# EAGLE design LUPA+uZED (EAGLE 8.3.1)
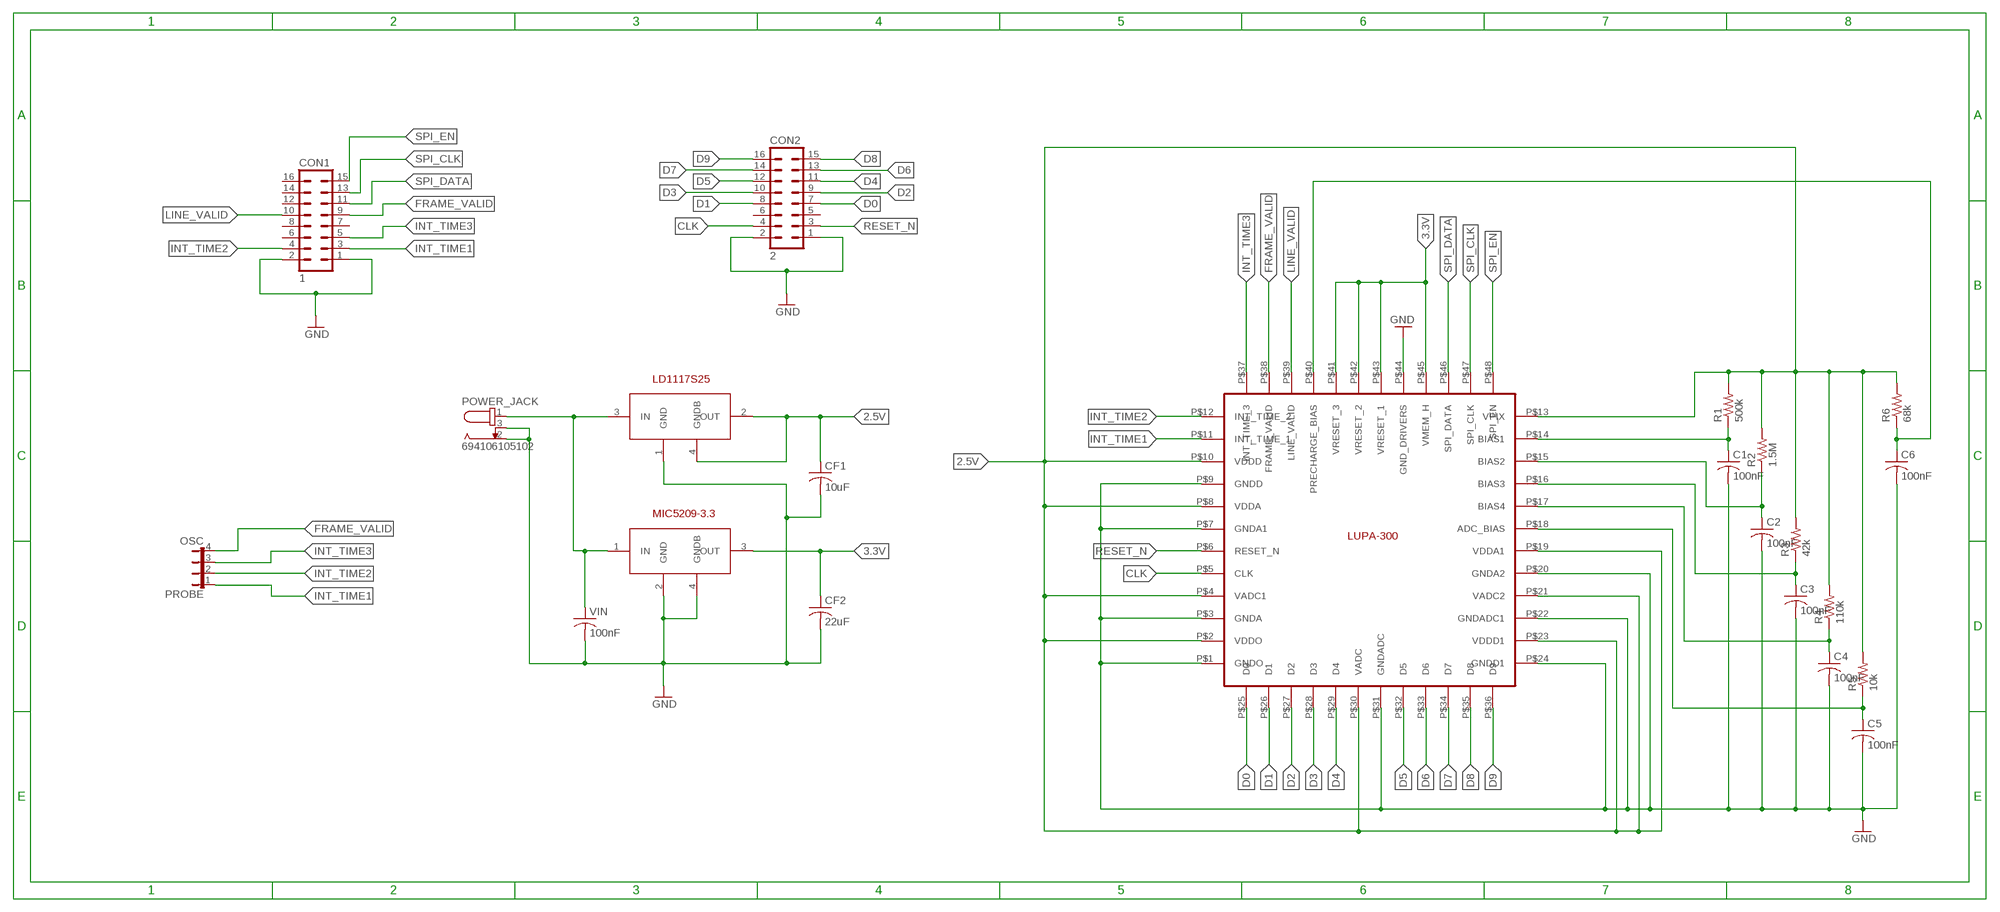
[diagram p0: schematic, sheet 1]

## Parts
C1  100nF  C-USC3216  [C3216]
C2  100nF  C-USC3216  [C3216]
C3  100nF  C-USC3216  [C3216]
C4  100nF  C-USC3216  [C3216]
C5  100nF  C-USC3216  [C3216]
C6  100nF  C-USC3216  [C3216]
CF1  10uF  C-USC3216  [C3216]
CF2  22uF  C-USC3216  [C3216]
CON1  1  MA08-2  [MA08-2]
CON2  2  MA08-2  [MA08-2]
POWER_JACK  694106105102  [694106105102]
PROBE  OSC  JP4E  [JP4]
R1  500k  R-US_R1206  [R1206]
R2  1.5M  R-US_R1206  [R1206]
R3  42k  R-US_R1206  [R1206]
R4  110k  R-US_R1206  [R1206]
R5  10k  R-US_R1206  [R1206]
R6  68k  R-US_R1206  [R1206]
U$1  IS  LUPA300  [LUPA300]
U$2  LD1117S25  [SOT223]
U$3  MIC5209-3.3  [SOT223]
VIN  100nF  C-USC3216  [C3216]

## Nets
2.5V: CF1.1 R1.2 R2.2 R3.2 R4.2 R5.2 R6.2 U$1.P$2(VDDO) U$1.P$4(VADC1) U$1.P$8(VDDA) U$1.P$10(VDDD) U$1.P$13(VPIX) U$1.P$19(VDDA1) U$1.P$21(VADC2) U$1.P$23(VDDD1) U$1.P$30(VADC) U$2.2(OUT) U$2.4(GNDB)
3.3V: CF2.1 U$1.P$41(VRESET_3) U$1.P$42(VRESET_2) U$1.P$43(VRESET_1) U$1.P$45(VMEM_H) U$3.3(OUT)
CLK: CON2.4 U$1.P$5(CLK)
D0: CON2.7 U$1.P$25(D0)
D1: CON2.8 U$1.P$26(D1)
D2: CON2.9 U$1.P$27(D2)
D3: CON2.10 U$1.P$28(D3)
D4: CON2.11 U$1.P$29(D4)
D5: CON2.12 U$1.P$32(D5)
D6: CON2.13 U$1.P$33(D6)
D7: CON2.14 U$1.P$34(D7)
D8: CON2.15 U$1.P$35(D8)
D9: CON2.16 U$1.P$36(D9)
FRAME_VALID: CON1.9 PROBE.4 U$1.P$38(FRAME_VALID)
GND: C1.2 C2.2 C3.2 C4.2 C5.2 C6.2 CF1.2 CF2.2 CON1.1 CON1.2 CON2.1 CON2.2 POWER_JACK.2 POWER_JACK.3 U$1.P$1(GNDO) U$1.P$3(GNDA) U$1.P$7(GNDA1) U$1.P$9(GNDD) U$1.P$20(GNDA2) U$1.P$22(GNDADC1) U$1.P$24(GNDD1) U$1.P$31(GNDADC) U$1.P$44(GND_DRIVERS) U$2.1(GND) U$3.2(GND) U$3.4(GNDB) VIN.2
INT_TIME1: CON1.3 PROBE.1 U$1.P$11(INT_TIME_1)
INT_TIME2: CON1.4 PROBE.2 U$1.P$12(INT_TIME_2)
INT_TIME3: CON1.5 PROBE.3 U$1.P$37(INT_TIME_3)
LINE_VALID: CON1.10 U$1.P$39(LINE_VALID)
N$2: C1.1 R1.1 U$1.P$14(BIAS1)
N$3: C2.1 R2.1 U$1.P$15(BIAS2)
N$4: C4.1 R4.1 U$1.P$17(BIAS4)
N$7: C3.1 R3.1 U$1.P$16(BIAS3)
N$8: C5.1 R5.1 U$1.P$18(ADC_BIAS)
N$10: C6.1 R6.1 U$1.P$40(PRECHARGE_BIAS)
N$11: POWER_JACK.1 U$2.3(IN) U$3.1(IN) VIN.1
RESET_N: CON2.3 U$1.P$6(RESET_N)
SPI_CLK: CON1.13 U$1.P$47(SPI_CLK)
SPI_DATA: CON1.11 U$1.P$46(SPI_DATA)
SPI_EN: CON1.15 U$1.P$48(SPI_EN)
Unconnected: CON1.6 CON1.7 CON1.8 CON1.12 CON1.14 CON1.16 CON2.5 CON2.6

## Library data of the parts
C1-C6 CF1 CF2 VIN = resistor:C-US: CAPACITOR, American symbol
CON1 CON2 = con-lstb:MA08-2: PIN HEADER; OC_FARNELL: unknown; OC_NEWARK: unknown
POWER_JACK = Wurth_Elektronik_Electromechanic_DC_Power_Jack_Connectors_rev15c:694106105102: WR-DC_DC Power Jack_Right Angled_SMT Center Pin Ø2.0_Plug ID Ø2.05_Plug OD Ø5.5_with Peg ;=>Code : Con_WR-DC_SMT_694106105102_694106105102 <http://katalog.we-online.de/media/images/eican/Con_WR-DC_SMT_694106105102_pf2.jpg> Details see: http://katalog.we-online.de/em/datasheet/6941xx105102.pdf Created 2014-10-08, Karrer Zheng 2014 (C) Wurth Elektronik
PROBE = jumper:JP4E: JUMPER
R1-R6 = resistor:R-US_: RESISTOR, American symbol
U$1 = lupa300:LUPA300
U$2 = LD1117S25:LD1117S25
U$3 = MIC5209-3.3:MIC5209-3.3

## Board
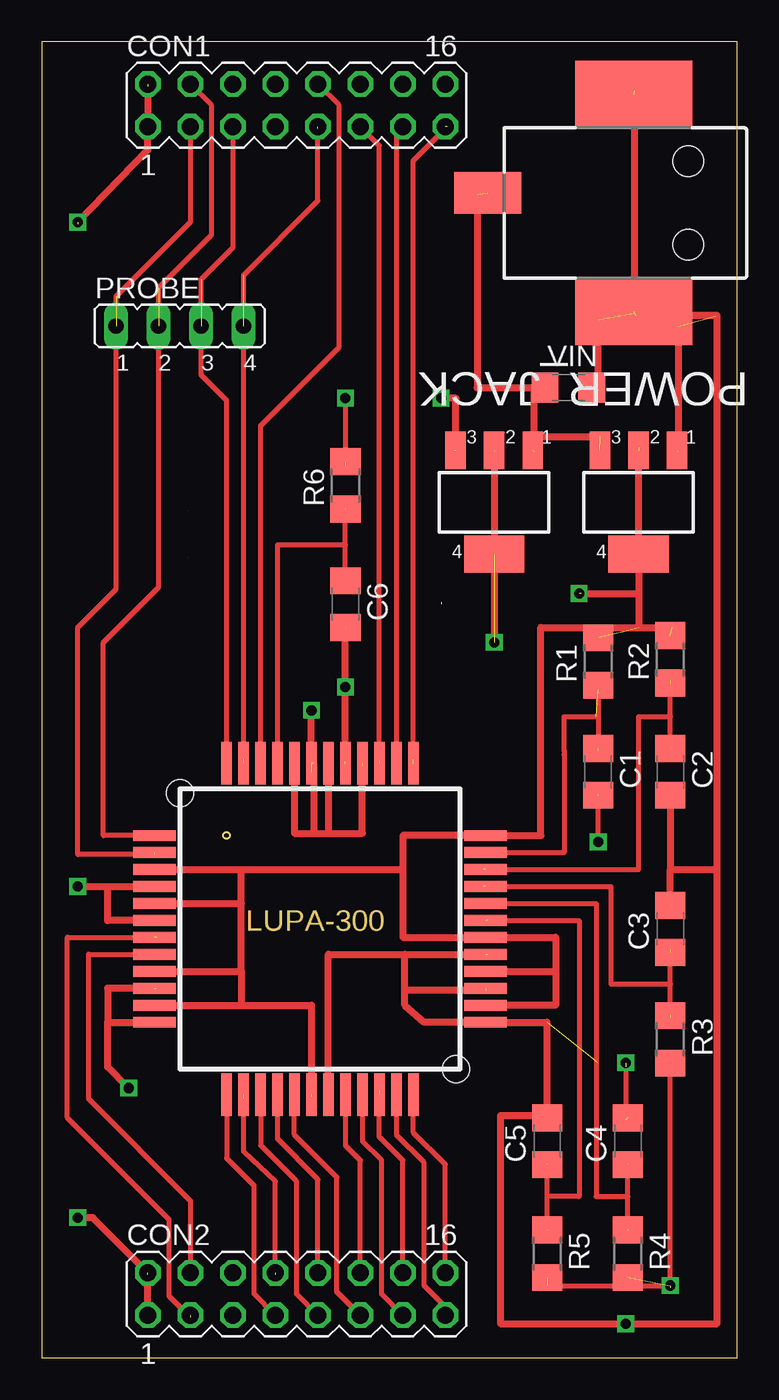
[diagram p1: board, top side]
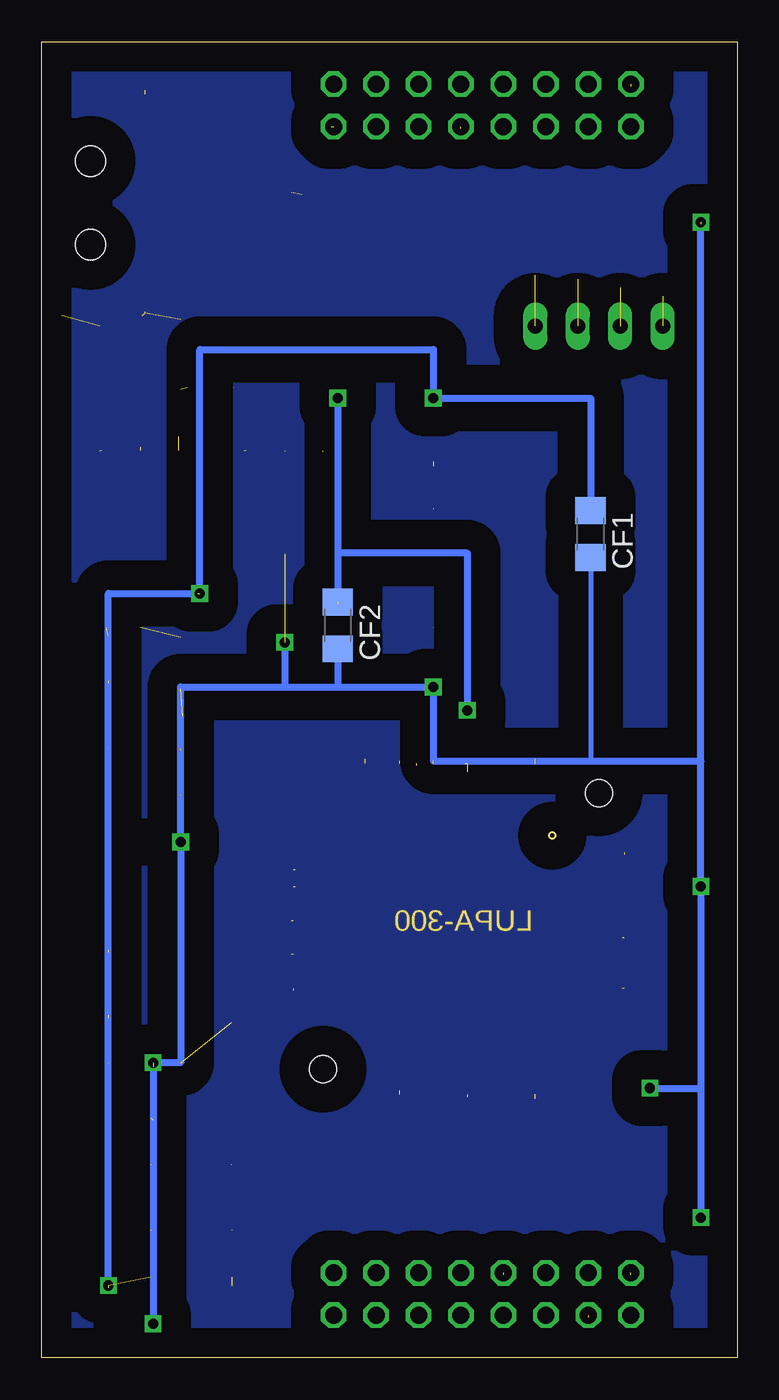
[diagram p2: board, bottom side, seen from below]

Size 41.58 x 78.73 mm. Coordinates in mm from the lower left corner, seen from the top.
Outline: 0,0 41.58,0 41.58,78.73 0,78.73 0,0
Copper layers (1*16): Top 0.035mm / dielectric 1.5mm / Bottom 0.035mm
Design rules "default *": minimum track width 6mil, minimum drill 0.35mm, track to track 0.1032mm, track to pad 0.1032mm, pad to pad 0.1032mm, via to via 0.1032mm, smd to smd 0.1032mm, copper to edge 40mil, drill to drill 6mil, minimum pad ring 10mil, minimum via ring 8mil, stop-mask expansion 4mil, vias tented up to drill 0mil, thermal gap 10mil

### Footprints (pad centres in the part's own frame; a part is rotated, then mirrored left to right if it is on the bottom)
C3216 = smd 1.6 x 1.8: 1 -1.4,0; 2 1.4,0
MA08-2 = drill 1.016 octagon: 1 -8.89,-1.27; 2 -8.89,1.27; 3 -6.35,-1.27; 4 -6.35,1.27; 5 -3.81,-1.27; 6 -3.81,1.27; 7 -1.27,-1.27; 8 -1.27,1.27; 9 1.27,-1.27; 10 1.27,1.27; 11 3.81,-1.27; 12 3.81,1.27; 13 6.35,-1.27; 14 6.35,1.27; 15 8.89,-1.27; 16 8.89,1.27
694106105102 = smd 4 x 2.5: 1 15.5,-0.6 | smd 7 x 4: 2 6.75,6.5; 3 6.75,-6.5 | hole 1.8: 3.5,2.5; 3.5,-2.5
JP4 = drill 0.914 long: 1 -3.81,0; 2 -1.27,0; 3 1.27,0; 4 3.81,0
R1206 = smd 1.6 x 1.803: 1 -1.422,0; 2 1.422,0
LUPA300 = smd 2.54 x 0.635: P$1 -2.794,1.524; P$2 -2.794,2.54; P$3 -2.794,3.556; P$4 -2.794,4.572; P$5 -2.794,5.588; P$6 -2.794,6.604; P$7 -2.794,7.62; P$8 -2.794,8.636; P$9 -2.794,9.652; P$10 -2.794,10.668; P$11 -2.794,11.684; P$12 -2.794,12.7; P$13 17.018,12.7; P$14 17.018,11.684; P$15 17.018,10.668; P$16 17.018,9.652; P$17 17.018,8.636; P$18 17.018,7.62; P$19 17.018,6.604; P$20 17.018,5.588; P$21 17.018,4.572; P$22 17.018,3.556; P$23 17.018,2.54; P$24 17.018,1.524 | smd 0.635 x 2.54: P$25 1.524,-2.794; P$26 2.54,-2.794; P$27 3.556,-2.794; P$28 4.572,-2.794; P$29 5.588,-2.794; P$30 6.604,-2.794; P$31 7.62,-2.794; P$32 8.636,-2.794; P$33 9.652,-2.794; P$34 10.668,-2.794; P$35 11.684,-2.794; P$36 12.7,-2.794; P$37 1.524,17.018; P$38 2.54,17.018; P$39 3.556,17.018; P$40 4.572,17.018; P$41 5.588,17.018; P$42 6.604,17.018; P$43 7.62,17.018; P$44 8.636,17.018; P$45 9.652,17.018; P$46 10.668,17.018; P$47 11.684,17.018; P$48 12.7,17.018 | hole 1.6: -1.27,15.24; 15.24,-1.27
SOT223 = smd 1.219 x 2.235: 1 -2.311,-3.099; 2 0,-3.099; 3 2.311,-3.099 | smd 3.6 x 2.2: 4 0,3.099

### Placement (x,y rotation side)
C1  33.27,35.05 270 top
C2  37.59,35.05 270 top
C3  37.59,25.65 90 top
C4  35.05,12.95 90 top
C5  30.23,12.95 90 top
C6  18.16,45.09 270 top
CF1  8.76,49.28 270 bottom
CF2  23.88,43.81 270 bottom
CON1  15.24,74.93 0 top
CON2  15.24,3.81 0 top
POWER_JACK  42.16,69.09 180 top
PROBE  8.26,61.72 0 top
R1  33.27,41.66 90 top
R2  37.59,41.78 90 top
R3  37.59,19.05 270 top
R4  35.05,6.22 270 top
R5  30.23,6.22 270 top
R6  18.16,52.2 90 top
U$1  9.53,18.54 0 top
U$2  35.69,51.18 180 top
U$3  27.05,51.18 180 top
VIN  31.5,58.04 0 top

### Tracks (layer width: path | path; a pad name or v marks a point on that pad's centre or on a via)
2.5V  (via drill 0.6)  (11 unrouted)
  Top 0.305: 30.23,4.32 v37.59,4.32 37.59,17.65 | v18.16,57.4 18.16,53.34
  Top 0.406: 21.59,29.21 21.59,31.24 U$1.P$13 29.84,31.24 29.84,43.69 35.69,43.69 | 21.59,29.21 21.59,25.15 U$1.P$19 | U$1.P$19 26.67,25.15 | U$1.P$10 11.94,29.21 | 11.94,29.21 21.59,29.21 | U$1.P$8 11.94,27.18 | 11.94,27.18 11.94,29.21 | 11.94,21.08 16.13,21.08 16.13,15.62 | U$1.P$4 11.94,23.11 | 11.94,23.11 11.94,27.18 | 11.94,23.11 11.94,21.08 | U$1.P$2 11.94,21.08 | U$1.P$19 30.73,25.15 30.73,23.11 | 30.73,23.11 30.73,21.08 U$1.P$23 | U$1.P$21 30.73,23.11 | 35.69,54.48 U$2.4 35.69,45.72 | 35.69,43.69 37.72,43.69 | 35.69,45.72 35.69,43.69 | v32.13,45.72 35.69,45.72
  Bottom 0.406: 37.59,4.19 37.59,45.72 32.26,45.72 | v32.13,45.72 32.13,60.33 18.16,60.33 v18.16,57.4 | v18.16,57.4 18.16,57.28 | v18.16,57.4 8.76,57.4 CF1.1
3.3V  (via drill 0.6)  (5 unrouted)
  Top 0.406: U$1.P$41 15.11,31.37 16.26,31.37 | 16.26,31.37 17.14,31.37 | 17.14,31.37 19.18,31.37 19.18,35.43 | 16.26,35.56 16.26,31.37 | U$1.P$43 17.14,31.37 | 24.77,54.23 24.77,57.4 v23.88,57.4 | 16.13,35.05 v16.13,38.73
  Bottom 0.406: v23.88,57.4 23.88,48.13 | 23.88,48.13 23.88,45.09 | v16.13,38.73 16.13,48.13 23.88,48.13
CLK
  Top 0.305: CON2.4 8.89,9.4 2.79,15.49 2.79,24.13 U$1.P$5
D0
  Top 0.305: CON2.7 12.7,3.81 12.7,10.29 11.05,11.94 11.05,15.48 | 11.05,15.48 11.05,15.62 | U$1.P$25 11.05,15.48
D1  (2 unrouted)
  Top 0.305: 13.97,4.95 13.97,10.54 12.06,12.32 12.06,15.49
D2
  Top 0.305: CON2.9 15.24,3.81 15.24,10.54 13.08,12.7 13.08,15.54 | 13.08,15.54 13.08,15.62 | U$1.P$27 13.08,15.54
D3
  Top 0.305: CON2.10 16.51,10.67 14.1,13.08 U$1.P$28
D4
  Top 0.305: CON2.11 17.65,3.94 17.65,10.79 15.11,13.34 15.11,15.11 | 15.11,15.24 15.11,15.88 | 15.11,15.24 15.11,15.11 | 15.11,15.11 15.24,14.99 | U$1.P$29 15.11,15.24
D5
  Top 0.305: CON2.12 19.05,11.81 18.16,12.7 U$1.P$32
D6
  Top 0.305: CON2.13 20.32,3.81 20.32,11.81 19.18,12.95 19.18,14.73 | 19.18,14.73 19.18,15.62 | U$1.P$33 19.18,14.73
D7  (1 unrouted)
  Top 0.305: CON2.14 21.59,11.81 20.19,13.21 20.19,16
D8
  Top 0.305: CON2.15 24.13,3.05 22.86,4.32 22.86,11.68 21.21,13.34 21.21,15.49 | 21.21,15.49 21.21,16 | U$1.P$35 21.21,15.49
D9
  Top 0.305: CON2.16 24.13,11.56 22.23,13.46 U$1.P$36
FRAME_VALID  (3 unrouted)
  Top 0.305: 12.06,35.81 12.06,64.77 16.51,69.22 16.51,73.53
GND  (via drill 0.6)  (23 unrouted)
  Top 0.305: v33.27,30.86 C1.2 | v34.92,17.65 34.92,14.22
  Top 0.406: U$1.P$31 17.14,24.13 21.72,24.13 | 21.72,24.13 26.67,24.13 | 26.54,21.97 21.72,21.97 | 21.72,21.97 21.72,24.13 | 21.72,21.97 21.72,21.08 22.86,20.07 U$1.P$24 30.23,20.07 30.23,14.48 | U$1.P$7 3.94,26.16 3.94,28.19 | 3.94,28.19 U$1.P$9 | 30.23,14.48 27.43,14.48 27.43,2.03 40.39,2.03 40.39,29.21 | 40.39,29.21 40.39,62.36 35.56,62.36 | C3.2 37.59,29.21 | 37.59,29.21 C2.2 37.59,31.5 | 37.59,29.21 40.39,29.21 | C5.2 30.23,14.48 | 35.43,75.82 35.43,62.48 | 33.27,57.91 33.27,62.1 | 38.1,54.23 38.1,61.72 | v2.16,28.19 3.94,28.19 | 6.86,22.1 3.94,22.1 3.94,20.07 | 3.94,20.07 U$1.P$1 | v5.21,16.13 3.94,17.4 3.94,20.07 | CON2.2 3.05,8.38 v2.16,8.38 | CON2.1 6.35,4.95 | 6.35,76.07 CON1.1 6.35,72.26 v2.16,67.94 | 27.05,54.23 v27.05,42.8 | U$1.P$44 C6.2
  Bottom 0.305: CF1.2 8.76,35.69
  Bottom 0.406: 2.16,16.13 v2.16,28.19 2.16,35.69 | 2.16,16.13 v2.16,8.38 | v5.21,16.13 2.16,16.13 | 2.16,35.69 2.16,67.82 | 27.05,40.13 33.27,40.13 v33.27,30.86 33.27,17.65 34.69,17.65 34.92,17.41 v34.92,2.03 | 27.05,40.13 23.88,40.13 | 23.88,40.13 v18.16,40.13 18.16,35.69 8.76,35.69 2.16,35.69 | 23.88,40.13 CF2.2 | v27.05,42.8 27.05,40.13
INT_TIME1  (2 unrouted)
  Top 0.305: 6.73,30.1 2.16,30.1 2.16,43.69 4.45,45.97 4.45,63.5 8.89,67.94 CON1.3
INT_TIME2  (1 unrouted)
  Top 0.305: U$1.P$12 3.68,31.24 3.68,42.8 6.99,46.1 6.99,64.01 10.16,67.18 10.16,74.93 CON1.4
INT_TIME3  (1 unrouted)
  Top 0.305: U$1.P$37 11.05,57.28 9.53,58.8 9.53,64.52 11.43,66.42 CON1.5
LINE_VALID
  Top 0.305: U$1.P$39 13.08,55.75 17.78,60.45 17.78,74.93 CON1.10
N$1
  pour Bottom (isolate 1.778): 0,78.74 0,0 41.91,0 41.91,78.74
N$2  (2 unrouted)
  Top 0.305: 33.27,36.32 33.27,40.01 33.27,40.39 | U$1.P$14 31.24,30.23 31.24,36.07 31.24,36.32 31.24,38.35 33.15,38.35
  Top 0.406: R1.1 33.27,40.01
N$3  (3 unrouted)
  Top 0.305: 26.42,29.21 35.69,29.21 35.69,36.2 35.69,36.32 35.69,38.35 37.59,38.35 | C2.1 37.59,38.35 | 37.59,38.35 37.59,40.51
N$4  (2 unrouted)
  Top 0.305: U$1.P$17 33.15,27.18 33.15,9.65 35.05,9.65 | 35.05,7.62 35.05,9.65 | 35.05,9.65 C4.1
N$7  (3 unrouted)
  Top 0.305: 26.42,28.19 34.04,28.19 34.04,22.35 37.59,22.35 | 37.59,20.32 37.59,22.35 | 37.59,22.35 37.59,24.38
N$8  (3 unrouted)
  Top 0.305: 26.67,26.16 32.13,26.16 32.13,9.65 30.23,9.65 | 30.23,7.62 30.23,9.65 | 30.23,9.65 C5.1
N$10  (1 unrouted)
  Top 0.305: C6.1 18.16,46.74 18.16,48.64 | 18.16,48.64 18.16,50.8 | U$1.P$40 14.1,48.64 18.16,48.64
  Top 0.406: C6.1 18.16,46.74
N$11  (4 unrouted)
  Top 0.406: 26.04,69.6 26.04,58.04 29.46,58.04 | 29.46,58.04 VIN.1 | 29.46,54.23 29.46,55.12 | 29.46,55.12 29.46,58.04 | 29.46,55.12 33.4,55.12
RESET_N  (2 unrouted)
  Top 0.305: 8.89,2.41 7.62,3.68 7.62,8.26 1.52,14.35 1.52,25.15 6.86,25.15
SPI_CLK
  Top 0.305: U$1.P$47 21.21,73.28 CON1.13
SPI_DATA  (1 unrouted)
  Top 0.305: 20.19,35.69 20.19,72.52 CON1.11
SPI_EN  (2 unrouted)
  Top 0.305: 22.23,35.81 22.23,71.63 24.26,73.66